# Altium project SWC.PrjPcb
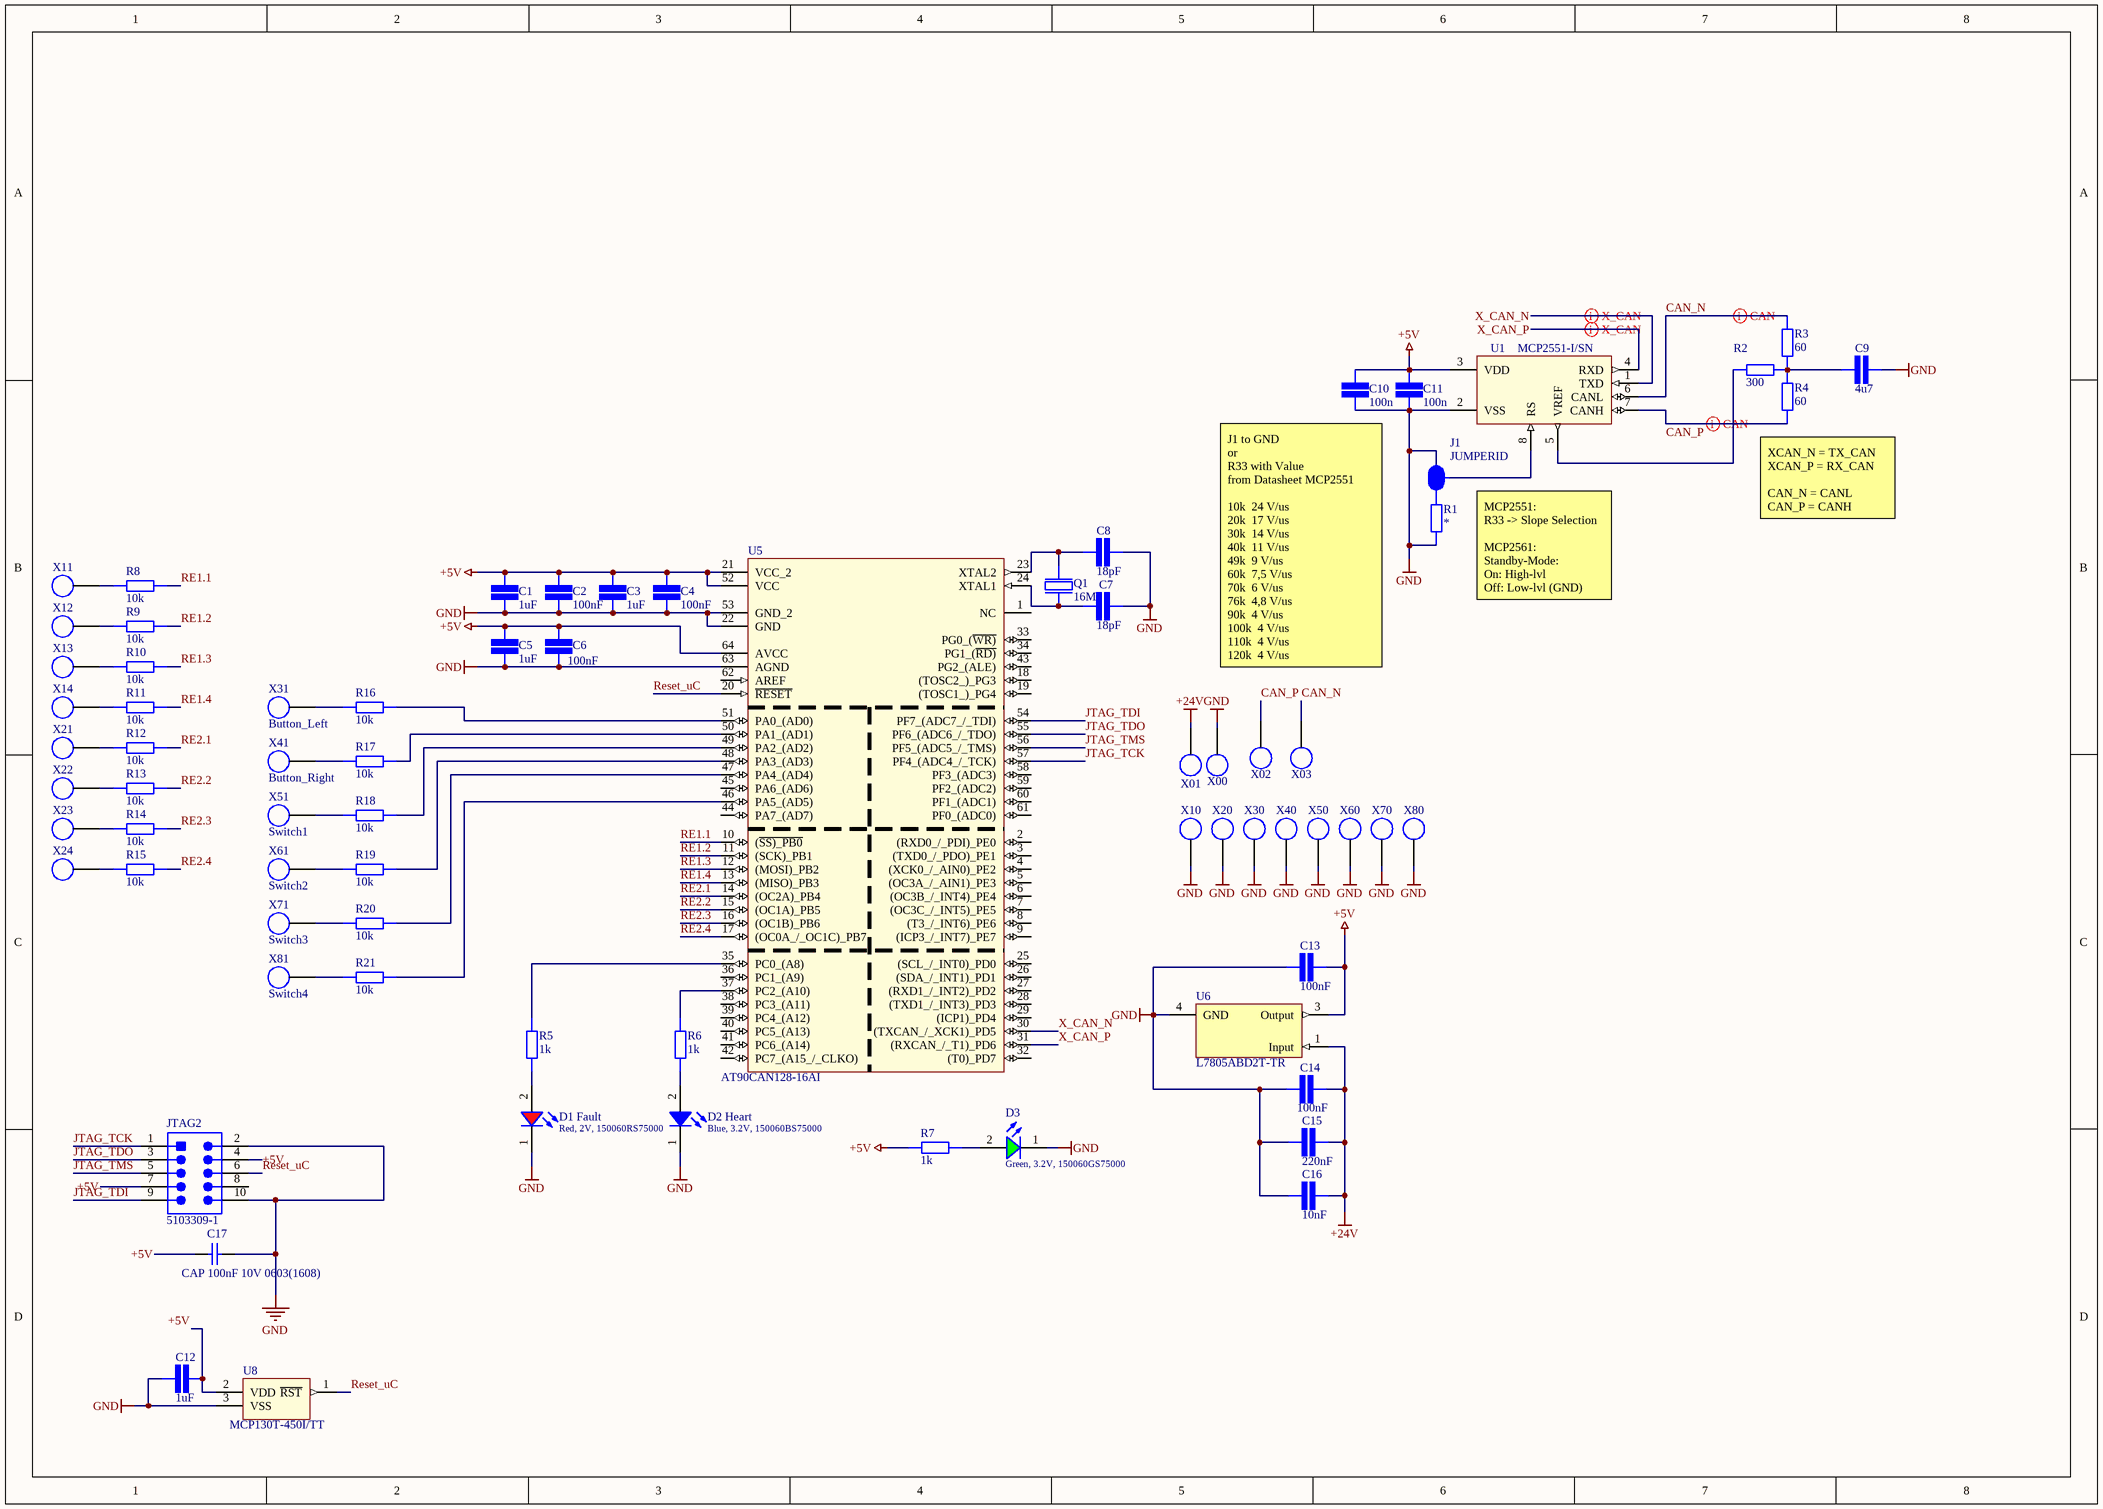
[diagram p0: SWC_P01.SchDoc]
1 sheet, 74 parts. Net scope: global (net labels, ports and power ports of the same name join across sheets).
Board file: SWC_PCBp1.PcbDoc

## Sheet SWC_P01.SchDoc
size A3; SheetNumber: 1; SheetTotal: 1

### Parts
C1  value 1uF  [CAP 0603/1608]  (hidden comment: SMD Capacitor)
C2  value 100nF  [CAP 0603/1608]  (hidden comment: SMD Capacitor)
C3  value 1uF  [CAP 0603/1608]  (hidden comment: SMD Capacitor)
C4  value 100nF  [CAP 0603/1608]  (hidden comment: SMD Capacitor)
C5  value 1uF  [CAP 0603/1608]  (hidden comment: SMD Capacitor)
C6  value 100nF  [CAP 0603/1608]  (hidden comment: SMD Capacitor)
C7  value 18pF  [CAP 0603/1608]  (hidden comment: SMD Capacitor)
C8  value 18pF  [CAP 0603/1608]  (hidden comment: SMD Capacitor)
C9  value 4u7  [CAP 0603/1608]  (hidden comment: SMD Capacitor)
C10  value 100n  [CAP 0603/1608]  (hidden comment: SMD Capacitor)
C11  value 100n  [CAP 0603/1608]  (hidden comment: SMD Capacitor)
C12  value 1uF  [CAP 0603/1608]  (hidden comment: SMD Capacitor)
C13  value 100nF  [CAP 0603/1608]  (hidden comment: SMD Capacitor)
C14  value 100nF  [CAP 0603/1608]  (hidden comment: SMD Capacitor)
C15  value 220nF  [CAP 0603/1608]  (hidden comment: SMD Capacitor)
C16  value 10nF  [CAP 0603/1608]  (hidden comment: SMD Capacitor)
C17  CAP 100nF 10V 0603(1608)  [CAPC0603(1608)100_L]
D1_Fault  Red, 2V, 150060RS75000  [WL-SMCW_0603_H=0.7mm]
D2_Heart  Blue, 3.2V, 150060BS75000  [WL-SMCW_0603_H=0.7mm]
D3  Green, 3.2V, 150060GS75000  [WL-SMCW_0603_H=0.7mm]
J1  JUMPERID  [SMD-JUMPER-3]  (net tie, no BOM)
JTAG2  5103309-1  [TECO-5103309-1_V]
Q1  16M  [NDK NX5032GA]
R1  SMD Resistor  [STACKPOLE CSR0603]  (value not drawn)
R2  value 300  [STACKPOLE CSR0603]  (hidden comment: SMD Resistor)
R3  value 60  [STACKPOLE CSR0603]  (hidden comment: SMD Resistor)
R4  value 60  [STACKPOLE CSR0603]  (hidden comment: SMD Resistor)
R5  value 1k  [STACKPOLE CSR0603]  (hidden comment: SMD Resistor)
R6  value 1k  [STACKPOLE CSR0603]  (hidden comment: SMD Resistor)
R7  value 1k  [STACKPOLE CSR0603]  (hidden comment: SMD Resistor)
R8  value 10k  [STACKPOLE CSR0603]  (hidden comment: SMD Resistor)
R9  value 10k  [STACKPOLE CSR0603]  (hidden comment: SMD Resistor)
R10  value 10k  [STACKPOLE CSR0603]  (hidden comment: SMD Resistor)
R11  value 10k  [STACKPOLE CSR0603]  (hidden comment: SMD Resistor)
R12  value 10k  [STACKPOLE CSR0603]  (hidden comment: SMD Resistor)
R13  value 10k  [STACKPOLE CSR0603]  (hidden comment: SMD Resistor)
R14  value 10k  [STACKPOLE CSR0603]  (hidden comment: SMD Resistor)
R15  value 10k  [STACKPOLE CSR0603]  (hidden comment: SMD Resistor)
R16  value 10k  [STACKPOLE CSR0603]  (hidden comment: SMD Resistor)
R17  value 10k  [STACKPOLE CSR0603]  (hidden comment: SMD Resistor)
R18  value 10k  [STACKPOLE CSR0603]  (hidden comment: SMD Resistor)
R19  value 10k  [STACKPOLE CSR0603]  (hidden comment: SMD Resistor)
R20  value 10k  [STACKPOLE CSR0603]  (hidden comment: SMD Resistor)
R21  value 10k  [STACKPOLE CSR0603]  (hidden comment: SMD Resistor)
U1  MCP2551-I/SN  [*SOIC127P600X175-8N]
U5  AT90CAN128-16AI  [*QFP80P1600X1600X120-64N]
U6  L7805ABD2T-TR  [DPAK254P1542X460-3M]
U8  MCP130T-450I/TT  [*SOT95P237X112-3N]
X00  SolderTerminal  [SolderTerminal]  (value not drawn)
X01  SolderTerminal  [SolderTerminal]  (value not drawn)
X02  SolderTerminal  [SolderTerminal]  (value not drawn)
X03  SolderTerminal  [SolderTerminal]  (value not drawn)
X10  SolderTerminal  [SolderTerminal]  (value not drawn)
X11  SolderTerminal  [SolderTerminal]  (value not drawn)
X12  SolderTerminal  [SolderTerminal]  (value not drawn)
X13  SolderTerminal  [SolderTerminal]  (value not drawn)
X14  SolderTerminal  [SolderTerminal]  (value not drawn)
X20  SolderTerminal  [SolderTerminal]  (value not drawn)
X21  SolderTerminal  [SolderTerminal]  (value not drawn)
X22  SolderTerminal  [SolderTerminal]  (value not drawn)
X23  SolderTerminal  [SolderTerminal]  (value not drawn)
X24  SolderTerminal  [SolderTerminal]  (value not drawn)
X30  SolderTerminal  [SolderTerminal]  (value not drawn)
X31  Button_Left  [SolderTerminal]
X40  SolderTerminal  [SolderTerminal]  (value not drawn)
X41  Button_Right  [SolderTerminal]
X50  SolderTerminal  [SolderTerminal]  (value not drawn)
X51  Switch1  [SolderTerminal]
X60  SolderTerminal  [SolderTerminal]  (value not drawn)
X61  Switch2  [SolderTerminal]
X70  SolderTerminal  [SolderTerminal]  (value not drawn)
X71  Switch3  [SolderTerminal]
X80  SolderTerminal  [SolderTerminal]  (value not drawn)
X81  Switch4  [SolderTerminal]

### Nets
+5V: C1.2 C2.2 C3.2 C4.2 C5.2 C6.2 C10.2 C11.2 C12.1 C13.1 C17.1 JTAG2.4 JTAG2.7 R7.2 U1.3(VDD) U5.21(VCC_2) U5.52(VCC) U5.64(AVCC) U6.3(Output) U8.2(VDD)
+24V: C14.1 C15.1 C16.1 U6.1(Input) X01.1(Terminal)
GND: C1.1 C2.1 C3.1 C4.1 C5.1 C6.1 C7.1 C8.1 C9.2 C10.1 C11.1 C12.2 C13.2 C14.2 C15.2 C16.2 C17.2 D1_Fault.1(K) D2_Heart.1(K) D3.1(K) J1.1 JTAG2.2 JTAG2.10 R1.1 U1.2(VSS) U5.22(GND) U5.53(GND_2) U5.63(AGND) U6.4(GND) U8.3(VSS) X00.1(Terminal) X10.1(Terminal) X20.1(Terminal) X30.1(Terminal) X40.1(Terminal) X50.1(Terminal) X60.1(Terminal) X70.1(Terminal) X80.1(Terminal)
CAN_N: R3.1 U1.6(CANL) X03.1(Terminal)
CAN_P: R4.2 U1.7(CANH) X02.1(Terminal)
JTAG_TCK: JTAG2.1 U5.57(PF4_(ADC4_/_TCK))
JTAG_TDI: JTAG2.9 U5.54(PF7_(ADC7_/_TDI))
JTAG_TDO: JTAG2.3 U5.55(PF6_(ADC6_/_TDO))
JTAG_TMS: JTAG2.5 U5.56(PF5_(ADC5_/_TMS))
RE1.1: R8.1 U5.10((~{SS)_PB0})
RE1.2: R9.1 U5.11((SCK)_PB1)
RE1.3: R10.1 U5.12((MOSI)_PB2)
RE1.4: R11.1 U5.13((MISO)_PB3)
RE2.1: R12.1 U5.14((OC2A)_PB4)
RE2.2: R13.1 U5.15((OC1A)_PB5)
RE2.3: R14.1 U5.16((OC1B)_PB6)
RE2.4: R15.1 U5.17((OC0A_/_OC1C)_PB7)
Reset_uC: JTAG2.6 U5.20(~{RESET}) U8.1(~{RST})
X_CAN_N: U1.1(TXD) U5.30((TXCAN_/_XCK1)_PD5)
X_CAN_P: U1.4(RXD) U5.31((RXCAN_/_T1)_PD6)
NetC7_2: C7.2 Q1.1 U5.24(XTAL1)
NetC8_2: C8.2 Q1.2 U5.23(XTAL2)
NetC9_1: C9.1 R2.2 R3.2 R4.1
NetD1_Fault_2: D1_Fault.2(A) R5.2
NetD2_Heart_2: D2_Heart.2(A) R6.2
NetD3_2: D3.2(A) R7.1
NetJ1_2: J1.2 U1.8(RS)
NetJ1_3: J1.3 R1.2
NetR2_1: R2.1 U1.5(VREF)
NetR5_1: R5.1 U5.35(PC0_(A8))
NetR6_1: R6.1 U5.37(PC2_(A10))
NetR8_2: R8.2 X11.1(Terminal)
NetR9_2: R9.2 X12.1(Terminal)
NetR10_2: R10.2 X13.1(Terminal)
NetR11_2: R11.2 X14.1(Terminal)
NetR12_2: R12.2 X21.1(Terminal)
NetR13_2: R13.2 X22.1(Terminal)
NetR14_2: R14.2 X23.1(Terminal)
NetR15_2: R15.2 X24.1(Terminal)
NetR16_1: R16.1 X31.1(Terminal)
NetR16_2: R16.2 U5.51(PA0_(AD0))
NetR17_1: R17.1 X41.1(Terminal)
NetR17_2: R17.2 U5.50(PA1_(AD1))
NetR18_1: R18.1 X51.1(Terminal)
NetR18_2: R18.2 U5.49(PA2_(AD2))
NetR19_1: R19.1 X61.1(Terminal)
NetR19_2: R19.2 U5.48(PA3_(AD3))
NetR20_1: R20.1 X71.1(Terminal)
NetR20_2: R20.2 U5.47(PA4_(AD4))
NetR21_1: R21.1 X81.1(Terminal)
NetR21_2: R21.2 U5.46(PA5_(AD5))

Not connected (* = marked no-connect by the designer): JTAG2 8; U5 1(NC) 2((RXD0_/_PDI)_PE0) 3((TXD0_/_PDO)_PE1) 4((XCK0_/_AIN0)_PE2) 5((OC3A_/_AIN1)_PE3) 6((OC3B_/_INT4)_PE4) 7((OC3C_/_INT5)_PE5) 8((T3_/_INT6)_PE6) 9((ICP3_/_INT7)_PE7) 18((TOSC2_)_PG3) 19((TOSC1_)_PG4) 25((SCL_/_INT0)_PD0) 26((SDA_/_INT1)_PD1) 27((RXD1_/_INT2)_PD2) 28((TXD1_/_INT3)_PD3) 29((ICP1)_PD4) 32((T0)_PD7) 33(PG0_(~{WR)}) 34(PG1_(~{RD)}) 36(PC1_(A9)) 38(PC3_(A11)) 39(PC4_(A12)) 40(PC5_(A13)) 41(PC6_(A14)) 42(PC7_(A15_/_CLKO)) 43(PG2_(ALE)) 44(PA7_(AD7)) 45(PA6_(AD6)) 58(PF3_(ADC3)) 59(PF2_(ADC2)) 60(PF1_(ADC1)) 61(PF0_(ADC0)) 62(AREF)

### Layout directives
differential pair: CAN_N, CAN_P, X_CAN_N, X_CAN_P

### Notes on the sheet
- (near R4) XCAN_N = TX_CAN
  XCAN_P = RX_CAN
  CAN_N = CANL
  CAN_P = CANH
- MCP2551:
  R33 -> Slope Selection
  MCP2561:
  Standby-Mode:
  On: High-lvl
  Off: Low-lvl (GND)
- J1 to GND
  or
  R33 with Value
  from Datasheet MCP2551
  10k  24 V/us
  20k  17 V/us
  30k  14 V/us
  40k  11 V/us
  49k  9 V/us
  60k  7,5 V/us
  70k  6 V/us
  76k  4,8 V/us
  90k  4 V/us
  100k  4 V/us
  110k  4 V/us
  120k  4 V/us

### Library data of the parts
C1-C16 = SMD Capacitor: Capacitor with multiple Footprints
C17 = CMP-1035-02579-1: CAP 100nF 10V ±5% 0603 (1608 Metric) Thickness 1mm SMD; Tolerance: Â±5%; Case-EIA: 0603; Case-Metric: 1608; Value: 100nF; Max Thickness: 1 mm; Rated Voltage: 10 V; Technology: SMT
D1_Fault = 150060RS75000: WL-SMCW SMT Mono-color Chip LED Waterclear, size 0603, Red, 2V, 140deg; Chip Technology: AlInGaP; Dominant Wavelength typ.: 625nm; Luminous Intensity typ.: 250mcd; Peak Wavelength typ.: 630nm; Viewing Angle: 140deg; ComponentLink1Description: Manufacturer; ComponentLink1URL: http://www.we-online.de; ComponentLink2URL: https://www.we-online.com/catalog/datasheet/150060RS75000.pdf; ComponentLink2Description: Datasheet; Forward Voltage typ.: 2V; Emitting Color: Red; Mounting Technology: SMT; Operating Temperature: -40 to +85degC; Published Date: December 2019; Part Number: 150060RS75000; Packaging: Tape and Reel; Size: 0603; Publisher: Wurth Elektronik
D2_Heart = 150060BS75000: WL-SMCW SMT Mono-color Chip LED Waterclear, size 0603, Blue, 3.2V, 140deg; Chip Technology: InGaN; Dominant Wavelength typ.: 470nm; Luminous Intensity typ.: 145mcd; Peak Wavelength typ.: 465nm; Viewing Angle: 140deg; ComponentLink1Description: Manufacturer; ComponentLink1URL: http://www.we-online.de; ComponentLink2URL: https://www.we-online.com/catalog/datasheet/150060BS75000.pdf; ComponentLink2Description: Datasheet; Forward Voltage typ.: 3.2V; Emitting Color: Blue; Mounting Technology: SMT; Operating Temperature: -40 to +85degC; Published Date: December 2019; Part Number: 150060BS75000; Packaging: Tape and Reel; Size: 0603; Publisher: Wurth Elektronik
D3 = 150060GS75000: WL-SMCW SMT Mono-color Chip LED Waterclear, size 0603, Green, 3.2V, 140deg; Chip Technology: InGaN; Dominant Wavelength typ.: 525nm; Luminous Intensity typ.: 430mcd; Peak Wavelength typ.: 515nm; Viewing Angle: 140deg; ComponentLink1Description: Manufacturer; ComponentLink1URL: http://www.we-online.de; ComponentLink2URL: https://www.we-online.com/catalog/datasheet/150060GS75000.pdf; ComponentLink2Description: Datasheet; Forward Voltage typ.: 3.2V; Emitting Color: Green; Mounting Technology: SMT; Operating Temperature: -40 to +85degC; Published Date: December 2019; Part Number: 150060GS75000; Packaging: Tape and Reel; Size: 0603; Publisher: Wurth Elektronik
J1 = SMD Jumper 3
JTAG2 = CMP-2000-07502-1: Male Header, Pitch 2.54 mm, 2 x 5 Position, Height 9.855 mm, Tail Length 3.048 mm, -65 to 105 degC, RoHS, Tube; Manufacturer: TE Connectivity; PCB Mounting Orientation: Vertical; Pitch: 2.54mm; Mating Connector Lock: No(Without); Body Material: Thermoplastic; Shrouded: Yes(With); Connector System: Wire-to-Board; Insulation Resistance: 5GR; Number of Positions: 10; Max Current Rating: 1A; PCB Mount Retention: Without; Manufacturer URL: http://www.te.com/; Contact Plating: Gold; Datasheet URL: http://www.te.com/commerce/DocumentDelivery/DDEController?Action=showdoc&DocId=Customer+Drawing%7F5103309%7FE1%7Fpdf%7FEnglish%7FENG_CD_5103309_E1.pdf%7F5103309-1; Colour: Black; Termination: ThroughHole; Housing Colour: Black; Flammability Rating: UL94V-0; Package Description: Male Header, Pitch 2.54 mm, 2 x 5 Position, Height 9.855 mm, Tail Length 3.048 mm; Mating Retention: No(Without); Orientation: Straight; Row Spacing: 2.54mm; Termination Post Length: 0.12inch; Min Operating Temperature: -65degC; Board Standoff: Yes(With); REACH SVHC: NoSVHC; Depth: 9.14mm; Lead Free: LeadFree; Gender: Male; Connector Type: Header; Shrouded End Dimension: 3.81mm; ELV: Compliant; Mating Alignment: Yes(With); Panel Mount Retention: No(Without); Package Quantity: 35; PCB Mount Alignment: No(Without); Number of Rows: 2; Package Reference: 5103309-1; Mounting Technology: ThroughHole; Mount: ThroughHole; Contact Gender: Male; Number of Contacts: 10; Length: 0.8inch; Current Rating: 1A; Contact Mating Length: 0.24inch; Max Operating Temperature: 105degC; RoHSCompliant: True; Datasheet Version: Rev. E1, 03/2011; Contact Shape: Square; Height: 8.813mm; Housing Material: PBT; Contact Material: CopperAlloy; Packaging: Rail/Tube
Q1 = 16 MHz Quartz
R1-R21 = SMD Resistor: Resistor with multiple footprints
  R1: Value: *
U1 = MCP2551-I/SN: MCP2551 Series 5.5 V 1 Mb/s Surface Mount High-Speed CAN Transceiver - SOIC-8; MF: Microchip; MP: MCP2551-I/SN; SnapEDA_Link: https://www.snapeda.com/parts/MCP2551-I/SN/Microchip/view-part/?ref=snap; Price: None; Package: SOIC-8 Microchip; Availability: Unavailable; Value: *
U5 = AT90CAN128-16AI: Ic Mcu 8bit 128kb Flash 64tqfp; MF: Microchip; MP: AT90CAN128-16AI; Package: TQFP-64 Microchip; SnapEDA_Link: https://www.snapeda.com/parts/AT90CAN128-16AI/Microchip/view-part/?ref=snap; Price: None; Availability: Unavailable; Value: *
U6 = L7805ABD2T-TR: Linear Voltage Regulators 5.0V 1.5A Positive
U8 = MCP130T-450I/TT: System Supervisors - Power Supply Monitors with Reset Generators Open Drain Low; MF: Microchip; MP: MCP120T-450I/TT; Price: None; SnapEDA_Link: https://www.snapeda.com/parts/MCP120T-450I/TT/Microchip/view-part/?ref=snap; Package: SOT-23-3 Microchip; Availability: Unavailable; Value: *
X31 X41 X51 X61 X71 X81 = SolderTerminal